# Altium schematic sheet Dual Z.SchDoc
size A
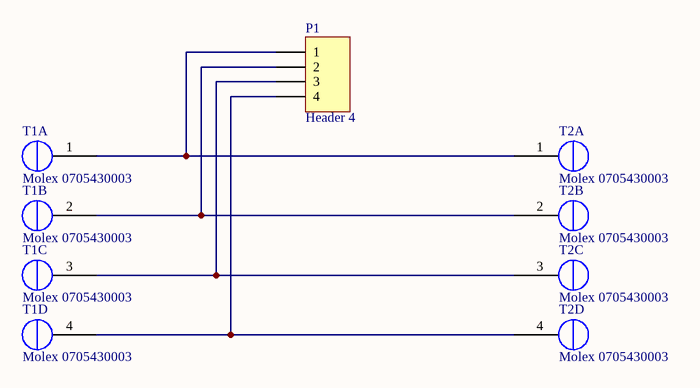
[diagram p0: Dual Z.SchDoc]

## Parts
P1  Header 4  [HDR1X4]
T1  Molex 0705430003  [Molex 0705430003]  (parts A,B,C,D of 4)
T2  Molex 0705430003  [Molex 0705430003]  (parts A,B,C,D of 4)

## Nets
NetP1_1: P1.1 T1.1(OUT2B) T2.1(OUT2B)
NetP1_2: P1.2 T1.2(OUT2A) T2.2(OUT2A)
NetP1_3: P1.3 T1.3(OUT1A) T2.3(OUT1A)
NetP1_4: P1.4 T1.4(OUT1B) T2.4(OUT1B)

## Library data of the parts
P1 = Header 4: Header, 4-Pin; LatestRevisionDate: 17-Jul-2002; LatestRevisionNote: Re-released for DXP Platform.; Publisher: Altium Limited
T1 T2 = Molex 0705430003 Alt: Molex 4 Pin Clip Connector